# Altium schematic sheet PERIPHERAL.SchDoc
size A
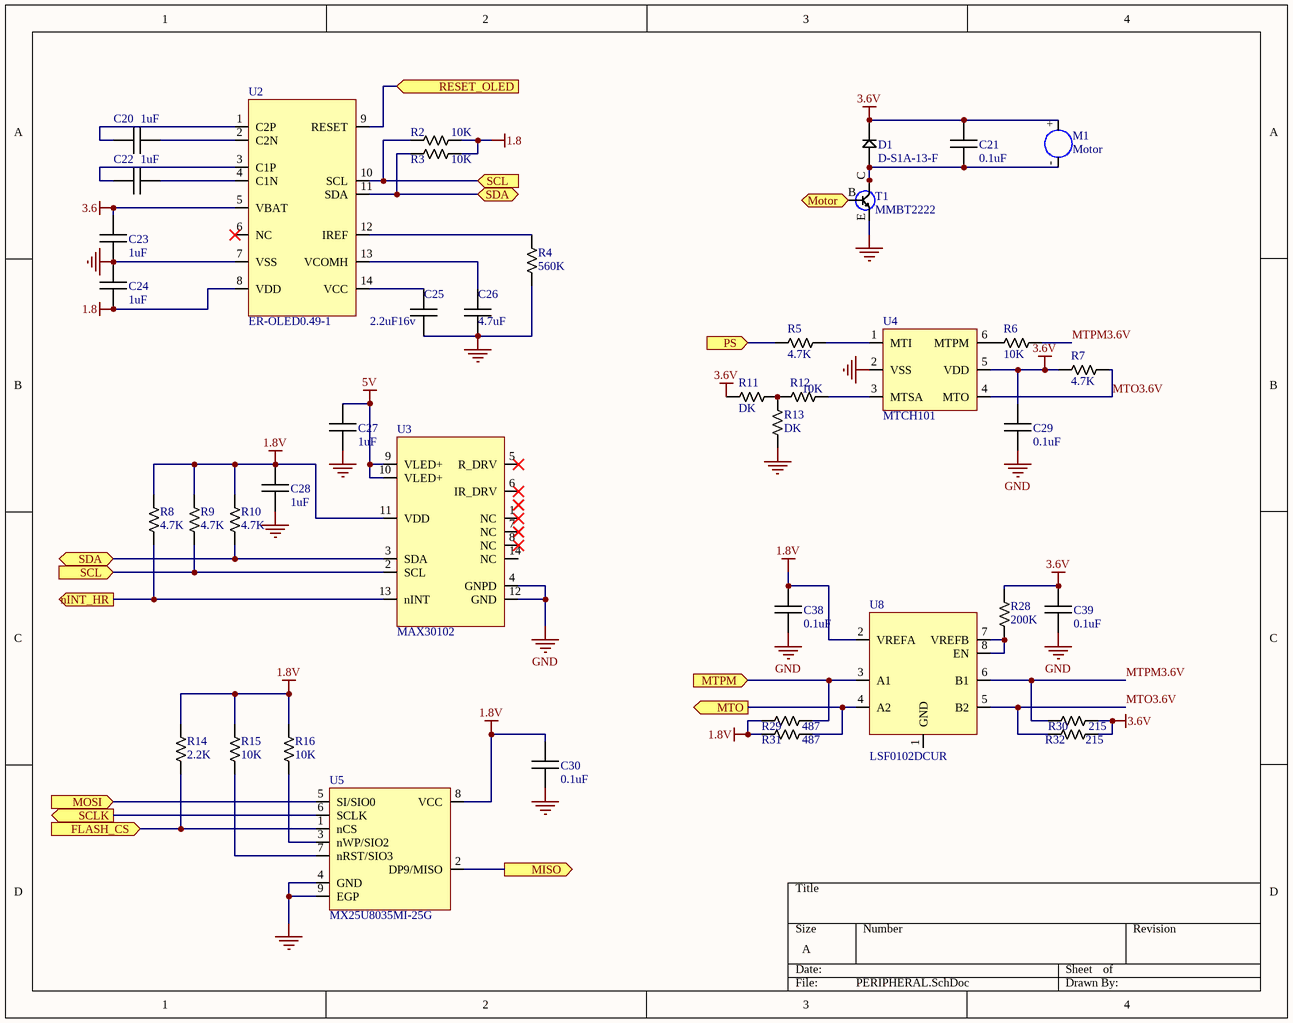
[diagram p0: PERIPHERAL.SchDoc]

## Parts
C20  1uF
C21  0.1uF
C22  1uF
C23  1uF
C24  1uF
C25  2.2uF16v
C26  4.7uF
C27  1uF
C28  1uF
C29  0.1uF
C30  0.1uF
C38  0.1uF
C39  0.1uF
D1  D-S1A-13-F
M1  Motor
R2  10K  [R0603]
R3  10K  [R0603]
R4  560K  [R0603]
R5  4.7K  [R0603]
R6  10K  [R0603]
R7  4.7K  [R0603]
R8  4.7K  [R0603]
R9  4.7K  [R0603]
R10  4.7K  [R0603]
R11  DK  [R0603]
R12  10K  [R0603]
R13  DK  [R0603]
R14  2.2K
R15  10K  [R0603]
R16  10K  [R0603]
R28  200K  [R0603]
R29  487  [R0603]
R30  215  [R0603]
R31  487  [R0603]
R32  215  [R0603]
T1  MMBT2222
U2  ER-OLED0.49-1
U3  MAX30102
U4  MTCH101
U5  MX25U8035MI-25G
U8  LSF0102DCUR

## Ports
FLASH_CS (in), MISO (out), MOSI (in), Motor (in), MTO (out), MTPM (in), nINT_HR (out), PS (in), RESET_OLED (in), SCL (in), SCLK (out), SDA (bidir)

## Nets
1.8: C24.2 R2.1 R3.1 U2.8(VDD)
1.8V: C28.2 C30.2 C38.2 R8.2 R9.2 R10.2 R14.2 R15.2 R16.2 R29.2 R31.2 U3.11(VDD) U5.8(VCC) U8.2(VREFA)
3.6: C23.2 U2.5(VBAT)
3.6V: C21.2 C29.2 C39.2 D1.1(-) M1.+ R7.2 R11.1 R28.2 R30.2 R32.2 U4.5(VDD)
5V: C27.2 U3.9(VLED+) U3.10(VLED+)
GND: C23.1 C24.1 C25.1 C26.1 C27.1 C28.1 C29.1 C30.1 C38.1 C39.1 R4.1 R13.1 T1.E U2.7(VSS) U3.4(GNPD) U3.12(GND) U4.2(VSS) U5.4(GND) U5.9(EGP)
FLASH_CS: R14.1 U5.1(nCS) ; port FLASH_CS
MISO: U5.2(DP9/MISO) ; port MISO
MOSI: U5.5(SI/SIO0) ; port MOSI
Motor: T1.B ; port Motor
MTO: R31.1 U8.4(A2) ; port MTO
MTO3.6V: R7.1 R32.1 U4.4(MTO) U8.5(B2)
MTPM: R29.1 U8.3(A1) ; port MTPM
MTPM3.6V: R6.2 R30.1 U8.6(B1)
nINT_HR: R8.1 U3.13(nINT) ; port nINT_HR
PS: R5.1 ; port PS
RESET_OLED: U2.9(RESET) ; port RESET_OLED
SCL: R2.2 R9.1 U2.10(SCL) U3.2(SCL) ; port SCL
SCLK: U5.6(SCLK) ; port SCLK
SDA: R3.2 R10.1 U2.11(SDA) U3.3(SDA) ; port SDA
NetC20_1: C20.1 U2.2(C2N)
NetC20_2: C20.2 U2.1(C2P)
NetC21_1: C21.1 D1.2(+) M1.- T1.C
NetC22_1: C22.1 U2.4(C1N)
NetC22_2: C22.2 U2.3(C1P)
NetC25_2: C25.2 U2.14(VCC)
NetC26_2: C26.2 U2.13(VCOMH)
NetR4_2: R4.2 U2.12(IREF)
NetR5_2: R5.2 U4.1(MTI)
NetR6_1: R6.1 U4.6(MTPM)
NetR11_2: R11.2 R12.1 R13.2
NetR12_2: R12.2 U4.3(MTSA)
NetR15_1: R15.1 U5.7(nRST/SIO3)
NetR16_1: R16.1 U5.3(nWP/SIO2)
NetR28_1: R28.1 U8.7(VREFB) U8.8(EN)

Not connected (* = marked no-connect by the designer): U2 6(NC)*; U3 1(NC)* 5(R_DRV)* 6(IR_DRV)* 7(NC)* 8(NC)* 14(NC); U8 1(GND)

## Library data of the parts
C20 C22-C24 C27 C28 = C1uF_0402: SMD_CAPACITOR; Voltage - Rated: 10V; Tolerance: ±10%; Packet: 0402; Digi-Key Part Number: 490-3890-1-ND; Capacitance: 1uF
C21 C29 C30 C38 C39 = C0.1uF_0402: SMD_CAPACITOR; Voltage - Rated: 6.3V; Tolerance: ±10%; Packet: 0402; Digi-Key Part Number: 490-6319-1-ND; Capacitance: 0.1uF
C25 = C2.2uF_0805: SMD_CAPACITOR; Voltage - Rated: 16V; Tolerance: ±10%; Packet: 0805; Digi-Key Part Number: 490-3906-1-ND; Capacitance: 2.2uF16v
C26 = C4.7uF_0805: SMD_CAPACITOR; Voltage - Rated: 16V; Tolerance: ±10%; Packet: 0805; Digi-Key Part Number: 445-1385-1-ND; Capacitance: 4.7uF
D1 = D-S1A-13-F: ="Description"; Description: DIODE GEN PURP 50V 1A SMA; Package: DO-214AC, SMA
M1 = Motor: vibrator coin 7mm; Digi-Key Part Number: 1670-1000-ND
R2 R3 R6 R12 R15 R16 = R10K_0201: SMD_RESISTOR; Packet: 0201; Tolerance: ±5%; Power: 1/20W; Digi-Key Part Number: 311-10KNCT-ND; Value: 10K
R4 = R560K_0402: SMD_RESISTOR; Packet: 0402; Tolerance: ±5%; Power: 1/16W; Digi-Key Part Number: 311-560KJRCT-ND; Value: 560K
R5 R7-R10 = R4.7K_0402: SMD_RESISTOR; Packet: 0402; Tolerance: ±1%; Power: 1/16W; Digi-Key Part Number: 311-4.7KLRCT-ND; Value: 4.7K
R11 R13 = RDK_0402: SMD_RESISTOR; Packet: 0402; Value: DK
R14 = R2.2K_0402: SMD_RESISTOR; Packet: 0402; Tolerance: ±1%; Power: 1/16W; Digi-Key Part Number: 311-2.20KLRCT-ND; Value: 2.2K
R28 = R200K_0201: SMD_RESISTOR; Packet: 0201; Tolerance: ±1%; Power: 1/20W; Digi-Key Part Number: 541-200KAABCT-ND; Value: 200K
R29 R31 = R487_0402: SMD_RESISTOR; Packet: 0402; Tolerance: ±1%; Power: 1/16W; Digi-Key Part Number: YAG2373CT-ND; Value: 487
R30 R32 = R215_0402: SMD_RESISTOR; Packet: 0402; Tolerance: ±1%; Power: 1/16W; Digi-Key Part Number: YAG3056TR-ND; Value: 215
T1 = MMBT2222: SMD_Transistor; Digi-Key Part Number: MMBT2222ALT1GOSCT-ND
U2 = ER-OLED0.49-1: OLED0.49; Website: http://www.buydisplay.com/default/low-power-smallest-blue-i2c-0-49-inch-64x32-oled-module-display-ssd1306
U3 = MAX30102: Heart rate; Digi-Key Part Number: MAX30102EFD+-ND
U4 = MTCH101: IC PROXIMITY DETECTOR SOT23-6; Digi-Key Part Number: MTCH101-I/OT-ND
U5 = MX25U8035MI-25G: IC FLASH 8MBIT 40MHZ 8SOP; Digi-Key Part Number: 1092-1119-ND
U8 = LSF0102DCUR: IC LEVEL TRANSLATOR BIDIR US8; Digi-Key Part Number: 296-39070-1-ND